# Altium project RasPagerADF7012.PrjPcb
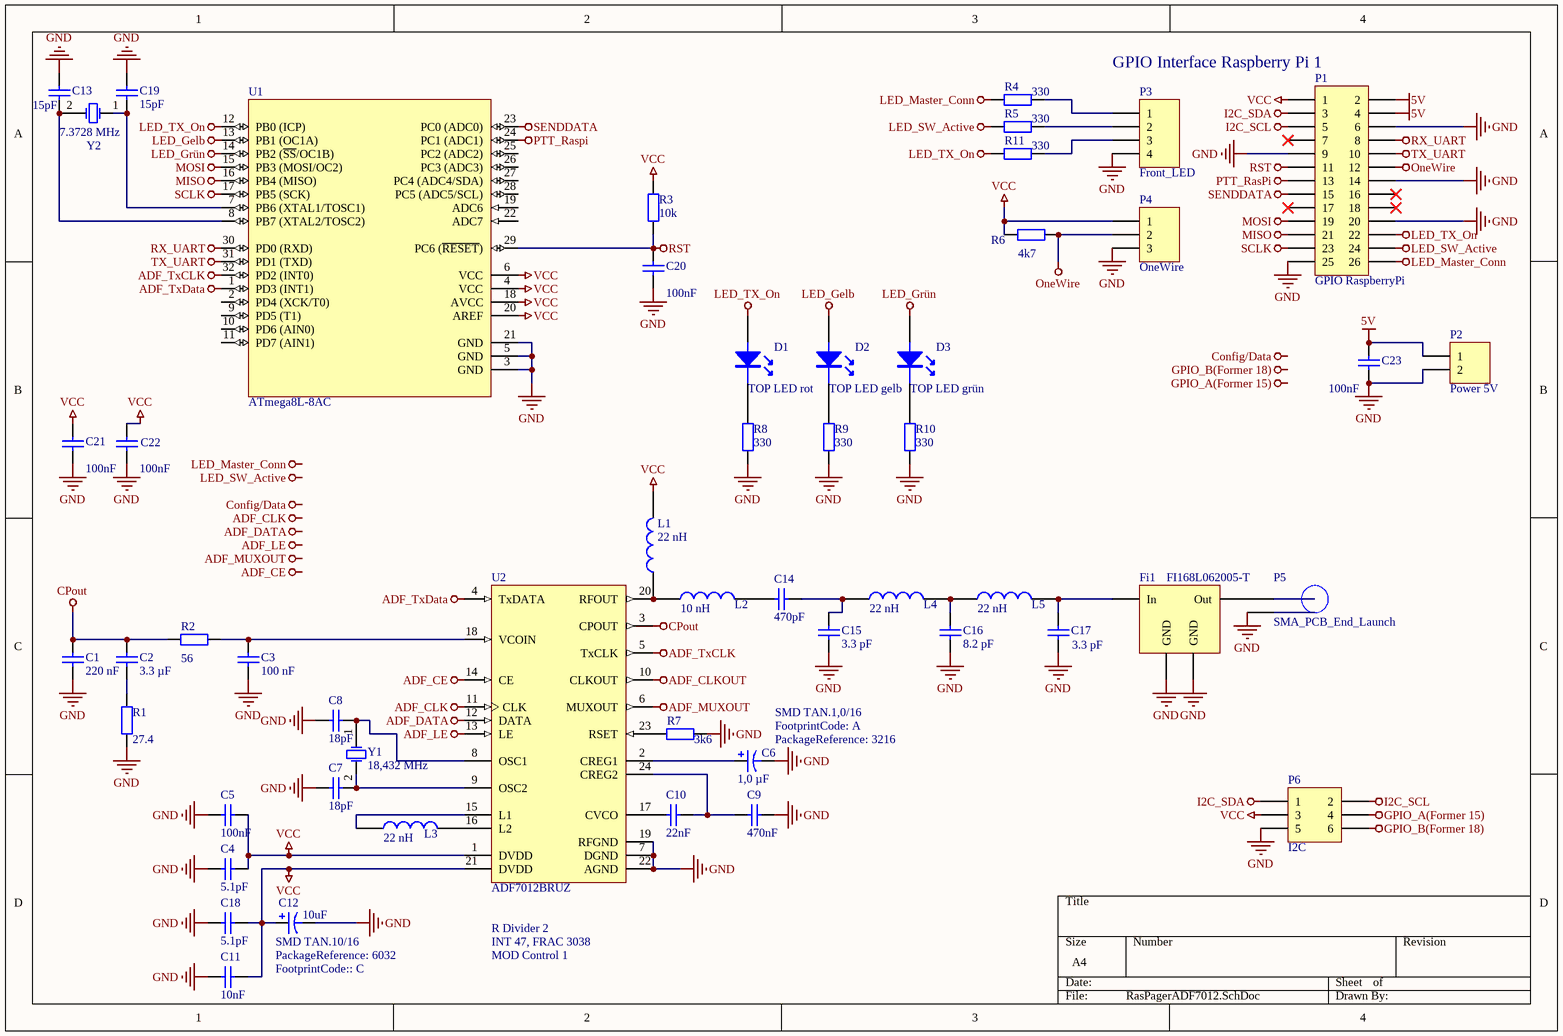
[diagram p0: RasPagerADF7012.SchDoc]
1 sheet, 53 parts. Net scope: global (net labels, ports and power ports of the same name join across sheets).
Board file: RasPagerADF7012.PcbDoc

## Sheet RasPagerADF7012.SchDoc
size A4; PageSetup: Record=PageOptions|CenterHorizontal=True|CenterVertical=True|PrintScale=1.00|XCorrection=1.00|YCorrection=1.00|PrintKind=0|BorderSize=5000000|LeftOffset=0|BottomOffset=0|Orientation=2|PaperLength=1000|PaperWidth=1000|Scale=100|PaperSource=7|PrintQuality=-3|MediaType=1|DitherType=10|PrintScaleMode=1|PaperKind=A4|PaperIndex=9

### Parts
C1  value 220 nF  [0603]  (hidden comment: Cap)
C2  value 3.3 µF  [0603]  (hidden comment: Cap)
C3  value 100 nF  [0603]  (hidden comment: Cap)
C4  value 5.1pF  [0603]  (hidden comment: Cap)
C5  value 100nF  [0603]  (hidden comment: Cap)
C6  1,0 µF  FootprintCode: A  Reichelt: SMD TAN.1,0/16  [3216]
C7  value 18pF  [0603]  (hidden comment: Cap)
C8  value 18pF  [0603]  (hidden comment: Cap)
C9  value 470nF  [0603]  (hidden comment: Cap)
C10  value 22nF  [0603]  (hidden comment: Cap)
C11  value 10nF  [0603]  (hidden comment: Cap)
C12  value 10uF  Reichelt: SMD TAN.10/16  FootprintCode:: C  [6032]  (hidden comment: 293D107X0004C2)
C13  value 15pF  [0603]  (hidden comment: Cap)
C14  value 470pF  [0603]  (hidden comment: Cap)
C15  value 3.3 pF  [0603]  (hidden comment: Cap)
C16  value 8.2 pF  [0603]  (hidden comment: Cap)
C17  value 3.3 pF  [0603]  (hidden comment: Cap)
C18  value 5.1pF  [0603]  (hidden comment: Cap)
C19  value 15pF  [0603]  (hidden comment: Cap)
C20  value 100nF  [0603]  (hidden comment: Cap)
C21  value 100nF  [0603]  (hidden comment: Cap)
C22  value 100nF  [0603]  (hidden comment: Cap)
C23  value 100nF  [0603]  (hidden comment: Cap)
D1  TOP LED rot  [0805]
D2  TOP LED gelb  [0805]
D3  TOP LED grün  [0805]
Fi1  FI168L062005-T  [FI 168L062005]
L1  22 nH  [0805]
L2  10 nH  [0805]
L3  22 nH  [0603]
L4  22 nH  [0805]
L5  22 nH  [0805]
P1  GPIO RaspberryPi  [HDR2X13]
P2  Power 5V  [HDR1X2]
P3  Front_LED  [HDR1X4]
P4  OneWire  [HDR1X3]
P5  SMA_PCB_End_Launch  [SMA_End_Launch_142-0701-801]
P6  I2C  [HDR2X3]
R1  value 27.4  [0603]
R2  value 56  [0603]
R3  value 10k  [0603]
R4  value 330  [0603]
R5  value 330  [0603]
R6  value 4k7  [0603]
R7  value 3k6  [0603]
R8  value 330  [0603]
R9  value 330  [0603]
R10  value 330  [0603]
R11  value 330  [0603]
U1  ATmega8L-8AC  [32A_N]
U2  ADF7012BRUZ  [ADI-RU-24_M]
Y1  18,432 MHz  [HC49/4H SMX]
Y2  7.3728 MHz  [HC49/4H SMX]

### Nets
5V: C23.2 P1.2 P1.4 P2.1
ADF_CE: U2.14(CE)
ADF_CLK: U2.11(CLK)
ADF_CLKOUT: U2.10(CLKOUT)
ADF_DATA: U2.12(DATA)
ADF_LE: U2.13(LE)
ADF_MUXOUT: U2.6(MUXOUT)
ADF_TxCLK: U1.32(PD2_(INT0)) U2.5(TxCLK)
ADF_TxData: U1.1(PD3_(INT1)) U2.4(TxDATA)
CPout: C1.2 C2.2 R2.2 U2.3(CPOUT)
GND: C1.1 C3.1 C4.2 C5.2 C6.2 C7.1 C8.1 C9.1 C11.2 C12.2 C13.1 C15.1 C16.1 C17.1 C18.2 C19.1 C20.1 C21.1 C22.1 C23.1 Fi1.3(GND) Fi1.4(GND) P1.6 P1.9 P1.14 P1.20 P1.25 P2.2 P3.4 P4.3 P5.2(Ground) P6.5 R1.1 R7.1 R8.1 R9.1 R10.1 U1.3(GND) U1.5(GND) U1.21(GND) U2.7(DGND) U2.19(RFGND) U2.22(AGND)
GPIO_A(Former 15): P6.4
GPIO_B(Former 18): P6.6
I2C_SCL: P1.5 P6.2
I2C_SDA: P1.3 P6.1
LED_Gelb: D2.1 U1.13(PB1_(OC1A))
LED_Grün: D3.1 U1.14(PB2_(~{SS}/OC1B))
LED_Master_Conn: P1.26 R4.1
LED_SW_Active: P1.24 R5.2
LED_TX_On: D1.1 P1.22 R11.2 U1.12(PB0_(ICP))
MISO: P1.21 U1.16(PB4_(MISO))
MOSI: P1.19 U1.15(PB3_(MOSI/OC2))
OneWire: P1.12 P4.2 R6.1
PTT_RasPi: P1.13 U1.24(PC1_(ADC1))
RST: C20.2 P1.11 R3.1 U1.29(PC6_(~{RESET}))
RX_UART: P1.8 U1.30(PD0_(RXD))
SCLK: P1.23 U1.17(PB5_(SCK))
SENDDATA: P1.15 U1.23(PC0_(ADC0))
TX_UART: P1.10 U1.31(PD1_(TXD))
VCC: C4.1 C5.1 C11.1 C12.1 C18.1 C21.2 C22.2 L1.2 P1.1 P4.1 P6.3 R3.2 R6.2 U1.4(VCC) U1.6(VCC) U1.18(AVCC) U1.20(AREF) U2.1(DVDD) U2.21(DVDD)
NetC2_1: C2.1 R1.2
NetC3_2: C3.2 R2.1 U2.18(VCOIN)
NetC6_1: C6.1 U2.2(CREG1)
NetC7_2: C7.2 U2.9(OSC2) Y1.2(OSC2)
NetC8_2: C8.2 U2.8(OSC1) Y1.1(OSC1)
NetC9_2: C9.2 C10.1 U2.24(CREG2)
NetC10_2: C10.2 U2.17(CVCO)
NetC13_2: C13.2 U1.8(PB7_(XTAL2/TOSC2)) Y2.2(OSC2)
NetC14_1: C14.1 L2.2
NetC14_2: C14.2 C15.2 L4.1
NetC16_2: C16.2 L4.2 L5.1
NetC17_2: C17.2 Fi1.1(In) L5.2
NetC19_2: C19.2 U1.7(PB6_(XTAL1/TOSC1)) Y2.1(OSC1)
NetD1_2: D1.2 R8.2
NetD2_2: D2.2 R9.2
NetD3_2: D3.2 R10.2
NetFi1_2: Fi1.2(Out) P5.1(Signal)
NetL1_1: L1.1 L2.1 U2.20(RFOUT)
NetL3_1: L3.1 U2.15(L1)
NetL3_2: L3.2 U2.16(L2)
NetP3_1: P3.1 R4.2
NetP3_2: P3.2 R5.1
NetP3_3: P3.3 R11.1
NetR7_2: R7.2 U2.23(RSET)

Not connected (* = marked no-connect by the designer): P1 7* 16* 17* 18*; U1 2(PD4_(XCK/T0)) 9(PD5_(T1)) 10(PD6_(AIN0)) 11(PD7_(AIN1)) 19(ADC6) 22(ADC7) 25(PC2_(ADC2)) 26(PC3_(ADC3)) 27(PC4_(ADC4/SDA)) 28(PC5_(ADC5/SCL))

### Notes on the sheet
- GPIO Interface Raspberry Pi 1
- R Divider 2
- INT 47, FRAC 3038
- MOD Control 1
- Labels drawn without touching a wire or pin: ADF_CE, ADF_CLK, ADF_DATA, ADF_LE, ADF_MUXOUT, Config/Data, GPIO_A(Former 15), GPIO_B(Former 18), LED_Master_Conn, LED_SW_Active

### Library data of the parts
C1-C5 C7-C11 C13-C23 = Cap: Capacitor; Published: 8-Jun-2000; LatestRevisionDate: 17-Jul-2002; LatestRevisionNote: Re-released for DXP Platform.; PackageReference: RAD-0.3; Publisher: Altium Limited
C6 = 293D106X0004A2: Tantamount Commercial, Surface Mount Solid Tantalum Chip Capacitor: 1,0uF, 20% Tolerance, 4 WVDC @ +85°C, Surge = 5.2V; Note: See Data Sheet for full range of components; Value: 10uF; Published: 19-Mar-2004; DatasheetDocument: 05-Feb-2003; PackageReference: 3216; Publisher: Altium Limited; Code_JEITA: 3216; ComponentLink1Description: Manufacturer Link; ComponentLink1URL: http://www.vishay.com/; ComponentLink2Description: Datasheet; ComponentLink2URL: http://www.vishay.com/docs/40002/293d.pdf
C12 = 293D107X0004C2: Tantamount Commercial, Surface Mount Solid Tantalum Chip Capacitor:10uF, 20% Tolerance, 4 WVDC @ +85°C, Surge = 5.2V; Note: See Data Sheet for full range of components; Published: 19-Mar-2004; DatasheetDocument: 05-Feb-2003; PackageReference: 6032; Publisher: Altium Limited; Code_JEITA: 6032; ComponentLink1Description: Manufacturer Link; ComponentLink1URL: http://www.vishay.com/; ComponentLink2Description: Datasheet; ComponentLink2URL: http://www.vishay.com/docs/40002/293d.pdf
D1-D3 = LED_2
L1 L2 L4 L5 = INDUCTOR
L3 = INDUCTOR: Reichelt: L-0805AS 22N
P1 = Header 13X2: Header, 13-Pin, Dual row; LatestRevisionDate: 17-Jul-2002; LatestRevisionNote: Re-released for DXP Platform.; Publisher: Altium Limited
P2 = Header 2: Header, 2-Pin; LatestRevisionDate: 17-Jul-2002; LatestRevisionNote: Re-released for DXP Platform.; Publisher: Altium Limited
P3 = Header 4: Header, 4-Pin; LatestRevisionDate: 17-Jul-2002; LatestRevisionNote: Re-released for DXP Platform.; Publisher: Altium Limited
P4 = Header 3: Header, 3-Pin; LatestRevisionDate: 17-Jul-2002; LatestRevisionNote: Re-released for DXP Platform.; Publisher: Altium Limited
P5 = SMA_PCB_End_Launch: Manufacturer: JOHNSON; PartNr: 142-0701-801; Farnell: 1608592
P6 = Header 3X2: Header, 3-Pin, Dual row; LatestRevisionDate: 17-Jul-2002; LatestRevisionNote: Re-released for DXP Platform.; Publisher: Altium Limited
R1-R11 = Res2: Resistor; Published: 8-Jun-2000; LatestRevisionDate: 17-Jul-2002; LatestRevisionNote: Re-released for DXP Platform.; PackageReference: AXIAL-0.4; Publisher: Altium Limited
U1 = ATmega8L-8AC: 8-Bit AVR Microcontroller with 8K Bytes of In-System Programmable Flash Memory; Published: 17-Sep-2003; LatestRevisionDate: 16-Oct-2006; LatestRevisionNote: IPC-7351 Footprint Added.; DatasheetVersion: 2486H-AVR-09/02; PackageVersion: revB, Oct-2001; PackageReference: 32A; Publisher: Altium Limited; PackageDescription: 32-Lead, 7x7x1.0 mm Body, 0.8mm Lead Pitch, Thin Profile Plastic Quad Flat Package (TQFP); Supplier 1: Digi-Key; Supplier Part Number 1: ATMEGA8L-8AC-ND; Supplier 2: Mouser; Supplier Part Number 2: 556-ATMEGA8L-8AC; Code_JEDEC: MS-026-ABA; ComponentLink1Description: Datasheet; ComponentLink1URL: http://www.atmel.com/dyn/resources/prod_documents/doc2486.pdf; ComponentLink2Description: Atmel.com Home; ComponentLink2URL: http://www.atmel.com
U2 = ADF7012BRUZ: Multichannel ISM Band FSK/GFSK/OOK/GOOK/ASK Transmitter, 75-1000 MHz Output Frequency, 179.2Kbps Maximum Data Rate, RU-24, Pb-Free, 62 Tube; Modulation Mode: FSK/ASK/GFSK, GOOK, OOK; Voltage Supply (V): 3.6V; Output Power: 14 dBm; Phase Noise Floor (dBc/Hz: 194dBc/Hz; Tx Current for 0 dBm (mA): 16mA; DatasheetVersion: RevA; PackageVersion: 2002; PackageReference: RU-24; PackageDescription: 24-Lead Thin Shrink Small Outline Package [TSSOP]; Output Frequency Range: 75-1000 MHz; Maximum Data Rate (kbps): 179.2Kbps; Code_JEDEC: MO-153AD; ComponentLink1Description: Manufacturer URL; ComponentLink1URL: www.analog.com; ComponentLink2Description: Datasheet; ComponentLink2URL: http://www.analog.com/static/imported-files/data_sheets/ADF7012.pdf; ComponentLink3Description: Package Specification; ComponentLink3URL: http://www.analog.com/static/imported-files/packages/380523655245964505593671154107510036154RU24.pdf
Y1 = XTAL: Crystal Oscillator; Part Nr: 9C-18.432MEEJ-T; Published: 8-Jun-2000; LatestRevisionDate: 17-Jul-2002; LatestRevisionNote: Re-released for DXP Platform.; PackageReference: R38; Publisher: Altium Limited; Farnell: 1842299
Y2 = XTAL: Crystal Oscillator; Part No: QCS7.37280F18B23M; Published: 8-Jun-2000; LatestRevisionDate: 17-Jul-2002; LatestRevisionNote: Re-released for DXP Platform.; PackageReference: R38; Publisher: Altium Limited; Farnell: 2508477
Fi1 = FI168L062005-T: Farnell: 2084801